# EAGLE design mosfet-h-bridge-v1 (EAGLE 6.2)
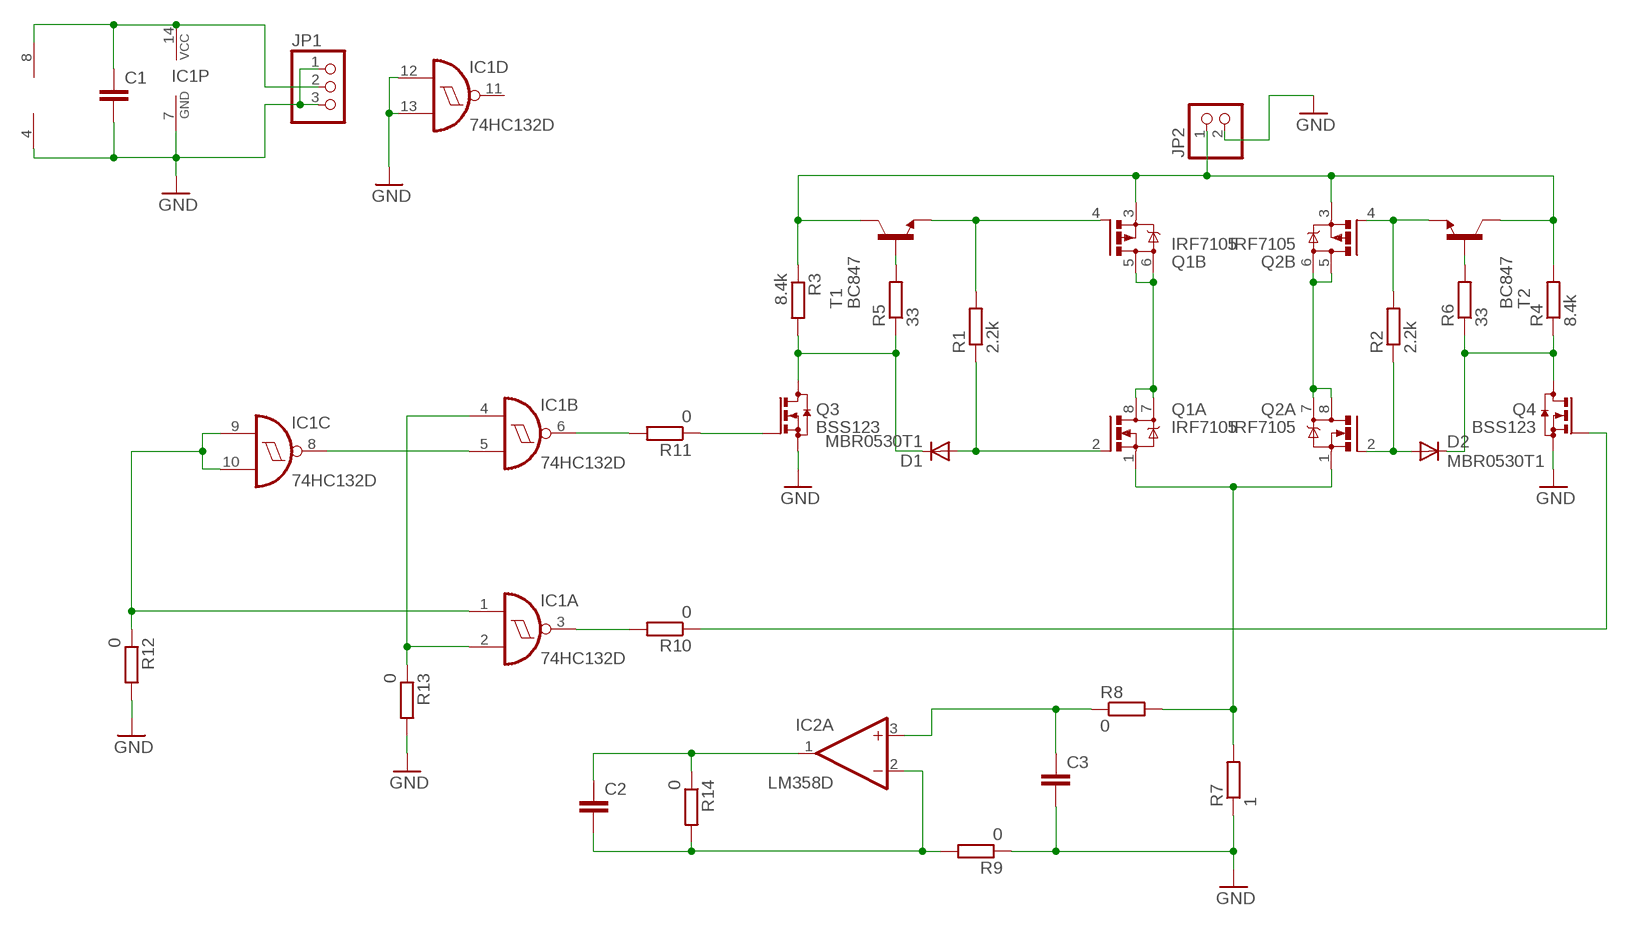
[diagram p0: schematic, sheet 1]

## Parts
C1  C-EUC1206K  [C1206K]
C2  C-EUC1206  [C1206]
C3  C-EUC1206  [C1206]
D1  MBR0530T1  [SOD123]
D2  MBR0530T1  [SOD123]
IC1  74HC132D  [SO14]
IC2  LM358D  [SO08]
JP1  PINHD-1X3  [1X03]
JP2  PINHD-1X2  [1X02]
Q1  IRF7105  [SO08]
Q2  IRF7105  [SO08]
Q3  BSS123  [SOT23]
Q4  BSS123  [SOT23]
R1  2.2k  R-EU_R1206S  [R1206S]
R2  2.2k  R-EU_R1206S  [R1206S]
R3  8.4k  R-EU_R1206S  [R1206S]
R4  8.4k  R-EU_R1206S  [R1206S]
R5  33  R-EU_R1206S  [R1206S]
R6  33  R-EU_R1206S  [R1206S]
R7  1  R-EU_R2512  [R2512]
R8  0  R-EU_R1206S  [R1206S]
R9  0  R-EU_R1206S  [R1206S]
R10  0  R-EU_R1206S  [R1206S]
R11  0  R-EU_R1206S  [R1206S]
R12  0  R-EU_R1206S  [R1206S]
R13  0  R-EU_R1206S  [R1206S]
R14  0  R-EU_R1206S  [R1206S]
T1  BC847  [SOT23]
T2  BC847  [SOT23]

## Nets
GND: C1.2 C3.2 IC1.7(P:GND) IC1.12(D:I0) IC1.13(D:I1) IC2.4(P:V-) JP1.1 JP1.3 JP2.2 Q3.2(S) Q4.2(S) R7.1 R9.1 R12.2 R13.2
N$1: D1.A Q1.2(A:G) R1.1
N$2: Q1.5(B:D) Q1.6(B:D1) Q1.7(A:D1) Q1.8(A:D)
N$3: Q1.4(B:G) R1.2 T1.2(E)
N$4: Q2.4(B:G) R2.2 T2.2(E)
N$5: Q1.1(A:S) Q2.1(A:S) R7.2 R8.2
N$7: D2.A Q2.2(A:G) R2.1
N$8: D1.C Q3.3(D) R3.2 R5.1
N$9: R5.2 T1.1(B)
N$10: JP2.1 Q1.3(B:S) Q2.3(B:S) R3.1 R4.2 T1.3(C) T2.3(C)
N$12: D2.C Q4.3(D) R4.1 R6.1
N$13: R6.2 T2.1(B)
N$14: C3.1 IC2.3(A:+IN) R8.1
N$15: Q2.5(B:D) Q2.6(B:D1) Q2.7(A:D1) Q2.8(A:D)
N$16: C2.2 IC2.2(A:-IN) R9.2 R14.2
N$17: C1.1 IC1.14(P:VCC) IC2.8(P:V+) JP1.2
N$18: IC1.6(B:O) R11.2
N$19: Q4.1(G) R10.1
N$20: IC1.1(A:I0) IC1.9(C:I0) IC1.10(C:I1) R12.1
N$21: IC1.2(A:I1) IC1.4(B:I0) R13.1
N$22: IC1.5(B:I1) IC1.8(C:O)
N$23: IC1.3(A:O) R10.2
N$32: Q3.1(G) R11.1
N$36: C2.1 IC2.1(A:OUT) R14.1
Unconnected: IC1.11(D:O) IC2.5(B:+IN) IC2.6(B:-IN) IC2.7(B:OUT)

## Library data of the parts
C1 = rcl:C-EU: CAPACITOR, European symbol
C2 C3 = resistor:C-EU: CAPACITOR, European symbol
D1 D2 = smirnov-arkady-all:MBR0530T1: SCHOTTKY BARRIER RECTIFIER Source: http://onsemi.com .. MBR0520LT1-D.pdf
IC1 = 74xx-eu:74*132: Quad 2-input NAND schmitt trigger
IC2 = linear:LM358: OP AMP also LM158; LM258; LM2904 Source: http://cache.national.com/ds/LM/LM158.pdf
JP1 = pinhead:PINHD-1X3: PIN HEADER
JP2 = pinhead:PINHD-1X2: PIN HEADER
Q1 Q2 = 0-svo-motor-mosfet:IRF7105
Q3 Q4 = transistor-small-signal:BSS123: N-CHANNEL MOS FET
R1-R6 R8-R14 = smirnov-arkady-all:R-EU_: RESISTOR, European symbol
R7 = resistor:R-EU_: RESISTOR, European symbol
T1 T2 = transistor:BC847: NPN TRANSISTOR

## Board
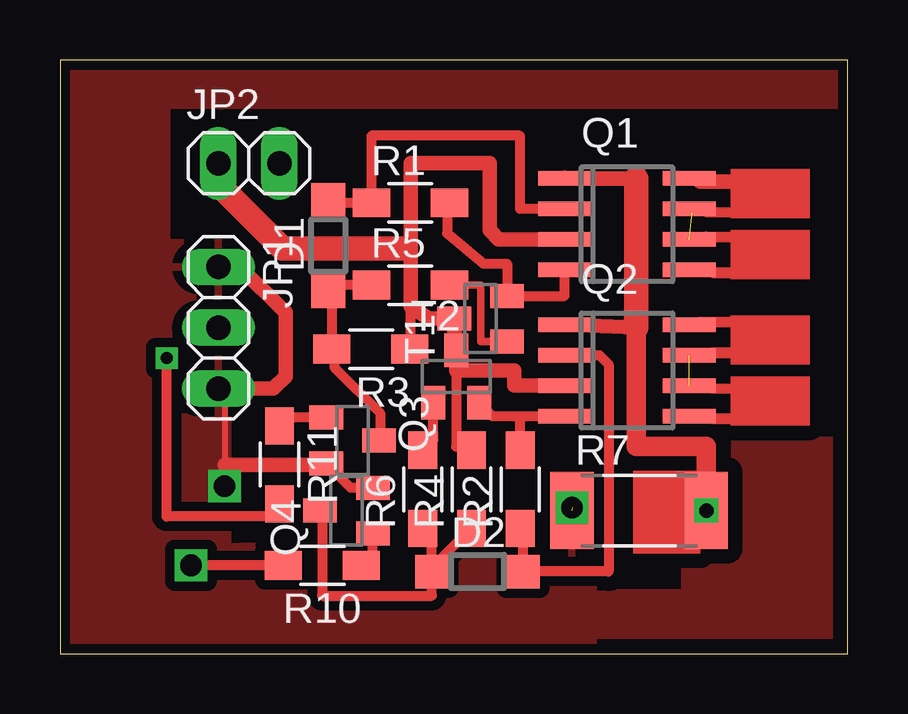
[diagram p1: board, top side]
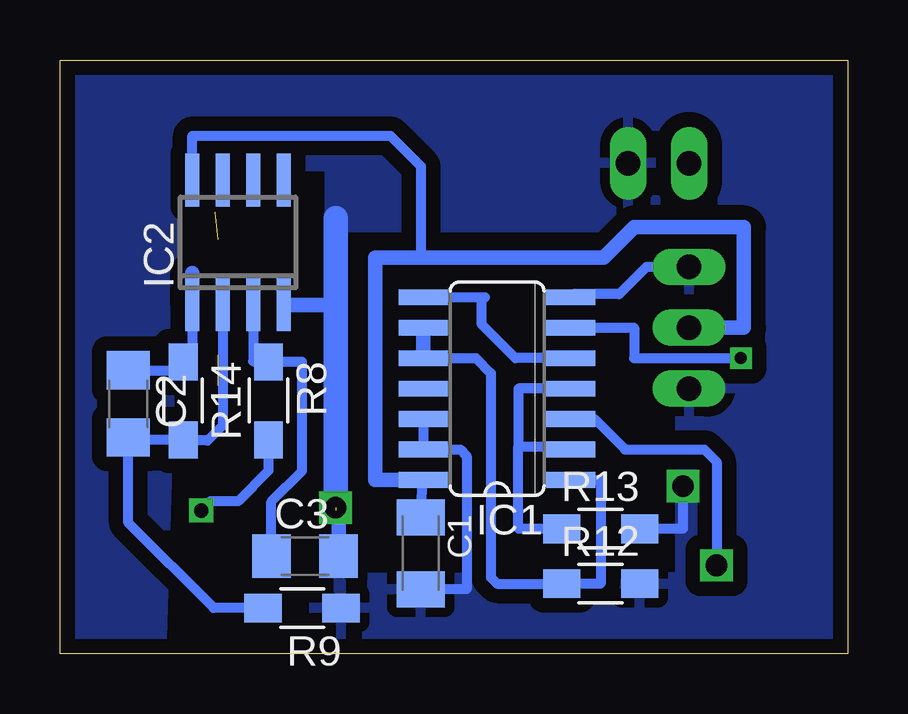
[diagram p2: board, bottom side, seen from below]

Size 32.82 x 24.75 mm. Coordinates in mm from the lower left corner, seen from the top.
Outline: 32.82,0 32.82,24.75 0,24.75 0,0 32.82,0
Copper layers (1*16): Top 0.035mm / dielectric 1.5mm / Bottom 0.035mm
Design rules: minimum track width 10mil, minimum drill 24mil, track to track 8mil, track to pad 8mil, pad to pad 8mil, via to via 8mil, smd to smd 8mil, copper to edge 10mil, drill to drill 8mil, minimum pad ring 10mil, minimum via ring 8mil, stop-mask expansion 4mil, vias tented up to drill 0mil, thermal gap 16mil

### Footprints (pad centres in the part's own frame; a part is rotated, then mirrored left to right if it is on the bottom)
C1206K = smd 1.5 x 2: 1 -1.5,0; 2 1.5,0
C1206 = smd 1.6 x 1.8: 1 -1.4,0; 2 1.4,0
SOD123 = smd 1.4 x 1.4: A 1.9,0; C -1.9,0
SO14 = smd 0.66 x 2.032: 1 -3.81,-3.073; 2 -2.54,-3.073; 3 -1.27,-3.073; 4 0,-3.073; 5 1.27,-3.073; 6 2.54,-3.073; 7 3.81,-3.073; 8 3.81,3.073; 9 2.54,3.073; 10 1.27,3.073; 11 0,3.073; 12 -1.27,3.073; 13 -2.54,3.073; 14 -3.81,3.073
SO08 = smd 0.6 x 2.2: 1 -1.905,-2.6; 2 -0.635,-2.6; 3 0.635,-2.6; 4 1.905,-2.6; 5 1.905,2.6; 6 0.635,2.6; 7 -0.635,2.6; 8 -1.905,2.6
1X03 = drill 1.016 long: 1 -2.54,0; 2 0,0; 3 2.54,0
1X02 = drill 1.016 long: 1 -1.27,0; 2 1.27,0
SOT23 = smd 1 x 1.4: 1 -0.95,-1.1; 2 0.95,-1.1; 3 0,1.1
R1206S = smd 1.546 x 1.2: 1 -1.626,0; 2 1.626,0
R2512 = smd 1.8 x 3.2: 1 -2.8,0; 2 2.8,0

### Placement (x,y rotation side)
C1  17.78,4.19 270 bottom
C2  29.97,10.41 270 bottom
C3  22.61,4.06 0 bottom
D1  11.18,17.02 90 top
D2  17.4,3.43 0 top
IC1  14.6,11.05 90 bottom
IC2  25.4,17.14 0 bottom
JP1  6.6,13.59 270 top
JP2  7.87,20.45 0 top
Q1  23.62,17.91 270 top
Q2  23.62,11.81 270 top
Q3  12.19,8.89 270 top
Q4  11.94,5.97 90 top
R1  14.6,18.8 0 top
R2  19.18,6.86 90 top
R3  12.95,12.7 180 top
R4  17.14,6.86 90 top
R5  14.6,15.37 0 top
R6  15.11,6.86 90 top
R7  24.13,5.97 0 top
R8  24.13,10.54 270 bottom
R9  22.73,1.91 180 bottom
R10  10.92,3.68 180 top
R11  9.14,7.87 270 top
R12  10.29,2.92 0 bottom
R13  10.29,5.21 0 bottom
R14  27.69,10.54 270 bottom
T1  17.53,13.97 90 top
T2  16.51,11.56 0 top

### Tracks (layer width: path | path; a pad name or v marks a point on that pad's centre or on a via)
GND  (via drill 0.9)  (1 unrouted)
  Top 0.254: 6.86,11.05 6.86,7.87 v6.86,6.99
  Top 0.406: 11.09,7.87 Q3.2 12.11,6.92 Q4.2 | 20.89,6.92 20.96,6.99 20.96,6.48 v21.34,6.1
  Top 0.61: 6.86,7.87 11.09,7.87 | JP1.1 7.49,16.13 9.4,14.22 9.4,11.56 8.89,11.05 6.86,11.05
  Bottom 0.406: JP1.1 8.38,16.13 9.53,14.99 11.4,14.99 IC1.7 | v6.86,6.99 6.86,5.21 R13.2 | IC1.12 IC1.13 16.13,8.51 15.87,8.26 15.87,2.69 C1.2
  Bottom 0.61: C3.2 21.21,5.97 v21.34,6.1 | IC2.4 21.34,14.54 21.34,13.97
  Bottom 1.016: 21.34,18.16 21.34,13.97 v21.34,6.1
  pour Top (isolate 0.406): -0.64,24.76 -0.64,-0.64 22.23,-0.64 22.23,5.08 6.98,4.45 6.98,17.14 4.45,17.14 4.45,22.86 33.66,22.86 33.02,24.76
  pour Top (isolate 0.61): 33.02,8.89 33.02,0 0,0 0,2.54 26.04,2.54 26.04,8.89
  pour Bottom (isolate 0.61): 0,24.76 32.38,24.76 32.38,0 28.57,0 27.94,20.32 21.59,20.32 21.59,17.78 6.98,17.78 6.98,3.17 12.7,3.17 12.7,0 0,0
  pour Bottom (isolate 0.61): 12.7,0 22.23,0 22.23,3.17 12.7,3.17
N$1
  Top 0.406: Q1.2 19.18,18.54 19.18,21.59 12.98,21.59 R1.1 11.18,18.8 D1.A
N$2  (1 unrouted)
  Top 0.254: Q1.5 28.07,16 28.57,16.51 28.57,17.14 28.45,17.27 Q1.6 | Q1.8 28.45,19.81 28.57,19.68 28.57,18.41 26.35,18.41 Q1.7
N$3
  Top 0.406: Q1.4 21.02,14.92 T1.2 18.63,16.26 17.65,16.26 16.13,17.53 16.13,18.77 R1.2
N$4
  Top 0.406: T2.2 18.01,9.91 19.18,9.91 | 19.18,9.91 Q2.4 | R2.2 19.18,9.91
N$5  (via drill 0.6)
  Top 0.406: 21.02,19.94 Q1.1
  Top 0.61: Q2.1 24,13.59 | 24,19.81 Q1.1
  Top 0.813: 24,13.59 24,8.64 26.93,8.64 R7.2
  Top 1.016: 24,19.81 24,13.59
  Bottom 0.406: 26.93,5.71 R7.2 26.55,6.35 25.4,6.35 24.13,7.62 R8.2
  other vias: 26.93,5.97
N$7
  Top 0.406: Q2.2 22.48,12.45 22.86,12.06 22.86,3.43 D2.A 19.3,5.11 R2.1
N$8
  Top 0.406: R3.2 11.43,12.57 | R3.2 11.43,12.7 11.43,11.94 13.33,10.03 13.33,8.93 Q3.3 | D1.C 11.33,14.86 | 11.33,14.86 R3.2 | R5.1 11.33,15.37 11.33,14.86
N$9
  Top 0.305: T1.1 17.53,13.02 17.53,15.37 R5.2
N$10
  Top 0.406: 16.38,13.93 T1.3 | 16.51,11.81 16.51,8.64 17.14,8.64 R4.2 | R3.1 14.6,12.7 14.6,15.24
  Top 0.61: 16.38,13.93 T2.3 16.51,11.81 18.92,11.81 18.92,11.18 Q2.3 | T1.3 15.37,13.97 14.6,14.48 14.6,15.24 14.6,17.14 | 14.6,17.14 14.6,20.45 17.91,20.45 17.91,17.65 18.29,17.27 Q1.3 | 14.35,16.89 14.6,17.14
  Top 1.016: 14.35,16.89 9.27,16.89 6.73,19.43 6.73,20.32 JP2.1
N$12
  Top 0.406: 15.5,3.59 D2.C 15.5,2.41 10.92,2.41 10.92,5.97 Q4.3 | 15.5,3.59 R4.1 | 15.5,3.59 15.5,4.85 R6.1
N$13
  Top 0.406: R6.2 15.56,8.93 T2.1
N$14
  Bottom 0.406: C3.1 24.01,6.35 22.73,7.62 22.73,12.17 R8.1 24.13,12.19 24.77,12.19 IC2.3
N$15  (1 unrouted)
  Top 0.254: Q2.5 28.32,9.91 28.57,10.16 28.57,11.05 26.35,11.05 Q2.6 | Q2.7 28.32,12.45 28.57,12.7 28.57,13.72 Q2.8
N$16
  Bottom 0.406: R9.2 26.42,1.91 29.97,5.46 C2.2 29.49,8.92 R14.2 27.28,8.89 26.67,8.89 26.04,9.53 IC2.2
N$17
  Bottom 0.406: C1.1 17.7,7.21 IC1.14 | IC2.8 27.3,21.59 19.05,21.59 17.78,20.32 17.78,16.51
  Bottom 0.61: JP1.2 4.32,13.59 4.32,17.78 8.89,17.78 10.16,16.51 17.78,16.51 19.69,16.51 19.69,7.24 IC1.14
N$18  (via drill 0.5)
  Top 0.406: R11.2 8.89,6.25 8.89,5.71 4.45,5.71 v4.45,12.32
  Bottom 0.406: IC1.6 8.89,13.59 8.89,12.32 v4.45,12.32
N$19
  Top 0.406: R10.1 13.04,3.68 Q4.1
N$20
  Bottom 0.406: IC1.10 15.49,12.32 14.86,11.68 14.86,3.17 14.6,2.92 R12.1 10.29,2.92 10.29,7.24 IC1.1
  Bottom 0.61: IC1.10 IC1.9
N$21
  Bottom 0.406: IC1.4 13.72,11.05 13.72,8.89 13.72,8.64 | 13.72,8.64 11.66,8.64 IC1.2 | R13.1 13.72,5.21 13.72,8.64
N$22
  Bottom 0.406: IC1.5 13.84,12.32 15.24,13.72 15.24,14.73 15.11,14.86 IC1.8
N$23  (via drill 0.9)
  Top 0.406: R10.2 v5.46,3.68
  Bottom 0.406: v5.46,3.68 5.46,8 5.97,8.51 9.27,8.51 10.54,9.78 IC1.3
N$24
  Top 0.406: 27.18,9.78 28.19,9.78
N$25
  Top 0.406: 26.67,13.84 28.45,13.84
N$26
  Top 0.406: 27.18,15.88 28.19,15.88
N$27
  Top 0.61: 26.67,19.68 27.94,19.68
N$28
  Top 0.406: 27.18,12.57 28.19,12.57
N$29
  Top 0.406: 27.18,11.05 28.19,11.05
N$30
  Top 0.406: 26.92,17.4 28.45,17.4
N$31
  Top 0.406: 26.92,18.41 28.45,18.41
N$32
  Top 0.406: Q3.1 9.14,9.84 R11.1
N$36
  Bottom 0.406: C2.1 27.66,11.81 R14.1 27.69,12.06 27.3,12.06 IC2.1
  Bottom 0.61: IC2.1 27.3,15.88
(copper drawn outside any net)
  shapes: Top area x5